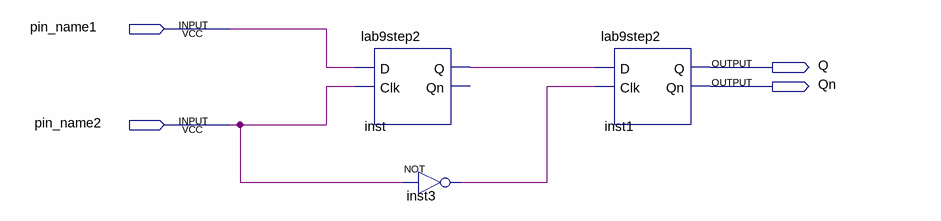
[diagram p0: schematic sheet]
// Quartus schematic lab9step3a.bdf as structural Verilog: 3 symbols, 4 pins
module lab9step3a (
  input  pin_name1,
  input  pin_name2,
  output Q,
  output Qn
);

  wire inst3_out, inst_q;

  lab9step2 inst (.D(pin_name1), .Clk(pin_name2), .Q(inst_q));  // open: Qn
  not inst3 (inst3_out, pin_name2);
  lab9step2 inst1 (.D(inst_q), .Clk(inst3_out), .Q(Q), .Qn(Qn));
endmodule
